# Altium schematic sheet MemoryUnit.SchDoc
size A
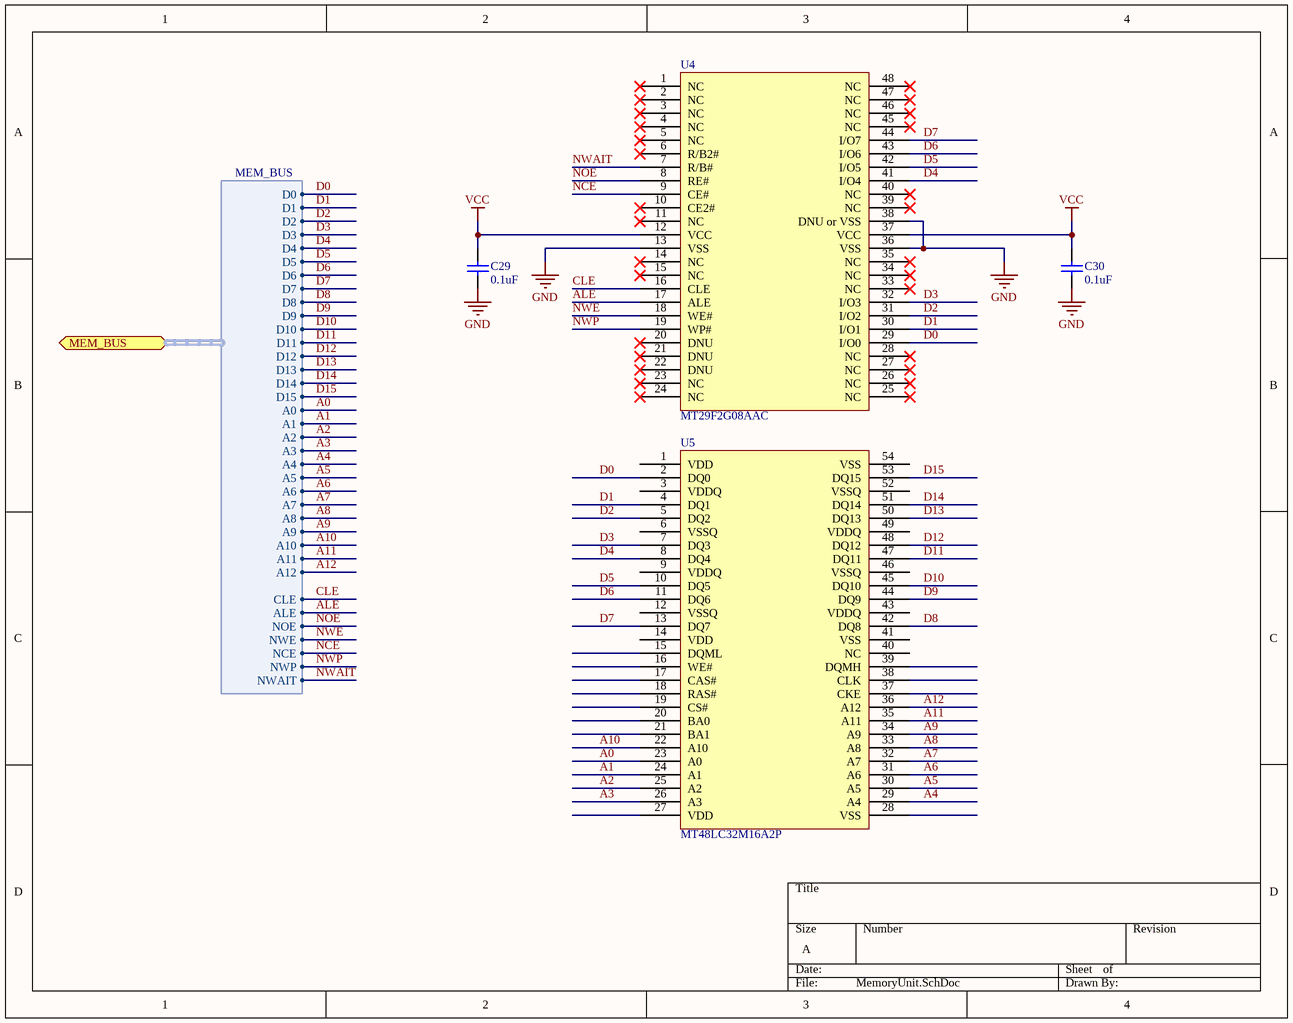
[diagram p0: MemoryUnit.SchDoc]

## Parts
C29  value 0.1uF  [CAP0603]  (hidden comment: ChipCap)
C30  value 0.1uF  [CAP0603]  (hidden comment: ChipCap)
U4  MT29F2G08AAC  [TSOP-I 48]
U5  MT48LC32M16A2P  [TSOP-II 54]

## Ports
MEM_BUS (harness MEM_BUS)

## Harnesses
MEM_BUS: D0, D1, D2, D3, D4, D5, D6, D7, D8, D9, D10, D11, D12, D13, D14, D15, CLE, ALE, NOE, NWE, NCE, NWP, NWAIT, A0, A1, A2, A3, A4, A5, A6, A7, A8, A9, A10, A11, A12

## Nets
GND: C29.1 C30.1 U4.13(VSS) U4.36(VSS) U4.38(DNU_or_VSS)
VCC: C29.2 C30.2 U4.12(VCC) U4.37(VCC)
A0: U5.23(A0) ; port MEM_BUS.A0
A1: U5.24(A1) ; port MEM_BUS.A1
A2: U5.25(A2) ; port MEM_BUS.A2
A3: U5.26(A3) ; port MEM_BUS.A3
A4: U5.29(A4) ; port MEM_BUS.A4
A5: U5.30(A5) ; port MEM_BUS.A5
A6: U5.31(A6) ; port MEM_BUS.A6
A7: U5.32(A7) ; port MEM_BUS.A7
A8: U5.33(A8) ; port MEM_BUS.A8
A9: U5.34(A9) ; port MEM_BUS.A9
A10: U5.22(A10) ; port MEM_BUS.A10
A11: U5.35(A11) ; port MEM_BUS.A11
A12: U5.36(A12) ; port MEM_BUS.A12
ALE: U4.17(ALE) ; port MEM_BUS.ALE
CLE: U4.16(CLE) ; port MEM_BUS.CLE
D0: U4.29(I/O0) U5.2(DQ0) ; port MEM_BUS.D0
D1: U4.30(I/O1) U5.4(DQ1) ; port MEM_BUS.D1
D2: U4.31(I/O2) U5.5(DQ2) ; port MEM_BUS.D2
D3: U4.32(I/O3) U5.7(DQ3) ; port MEM_BUS.D3
D4: U4.41(I/O4) U5.8(DQ4) ; port MEM_BUS.D4
D5: U4.42(I/O5) U5.10(DQ5) ; port MEM_BUS.D5
D6: U4.43(I/O6) U5.11(DQ6) ; port MEM_BUS.D6
D7: U4.44(I/O7) U5.13(DQ7) ; port MEM_BUS.D7
D8: U5.42(DQ8) ; port MEM_BUS.D8
D9: U5.44(DQ9) ; port MEM_BUS.D9
D10: U5.45(DQ10) ; port MEM_BUS.D10
D11: U5.47(DQ11) ; port MEM_BUS.D11
D12: U5.48(DQ12) ; port MEM_BUS.D12
D13: U5.50(DQ13) ; port MEM_BUS.D13
D14: U5.51(DQ14) ; port MEM_BUS.D14
D15: U5.53(DQ15) ; port MEM_BUS.D15
NCE: U4.9(CE#) ; port MEM_BUS.NCE
NOE: U4.8(RE#) ; port MEM_BUS.NOE
NWAIT: U4.7(R/B#) ; port MEM_BUS.NWAIT
NWE: U4.18(WE#) ; port MEM_BUS.NWE
NWP: U4.19(WP#) ; port MEM_BUS.NWP

Not connected (* = marked no-connect by the designer): U4 1(NC)* 2(NC)* 3(NC)* 4(NC)* 5(NC)* 6(R/B2#)* 10(CE2#)* 11(NC)* 14(NC)* 15(NC)* 20(DNU)* 21(DNU)* 22(DNU)* 23(NC)* 24(NC)* 25(NC)* 26(NC)* 27(NC)* 28(NC)* 33(NC)* 34(NC)* 35(NC)* 39(NC)* 40(NC)* 45(NC)* 46(NC)* 47(NC)* 48(NC)*; U5 1(VDD) 3(VDDQ) 6(VSSQ) 9(VDDQ) 12(VSSQ) 14(VDD) 15(DQML) 16(WE#) 17(CAS#) 18(RAS#) 19(CS#) 20(BA0) 21(BA1) 27(VDD) 28(VSS) 37(CKE) 38(CLK) 39(DQMH) 40(NC) 41(VSS) 43(VDDQ) 46(VSSQ) 49(VDDQ) 52(VSSQ) 54(VSS)

## Library data of the parts
C29 C30 = ChipCap: Capacitor; Published: 8-Jun-2000; LatestRevisionDate: 17-Jul-2002; LatestRevisionNote: Re-released for DXP Platform.; PackageReference: RAD-0.3; Publisher: Altium Limited
U5 = MT48LC32M16A2P: SDRAM 512Mb x16